# EAGLE design 1 (EAGLE 8.5.0)
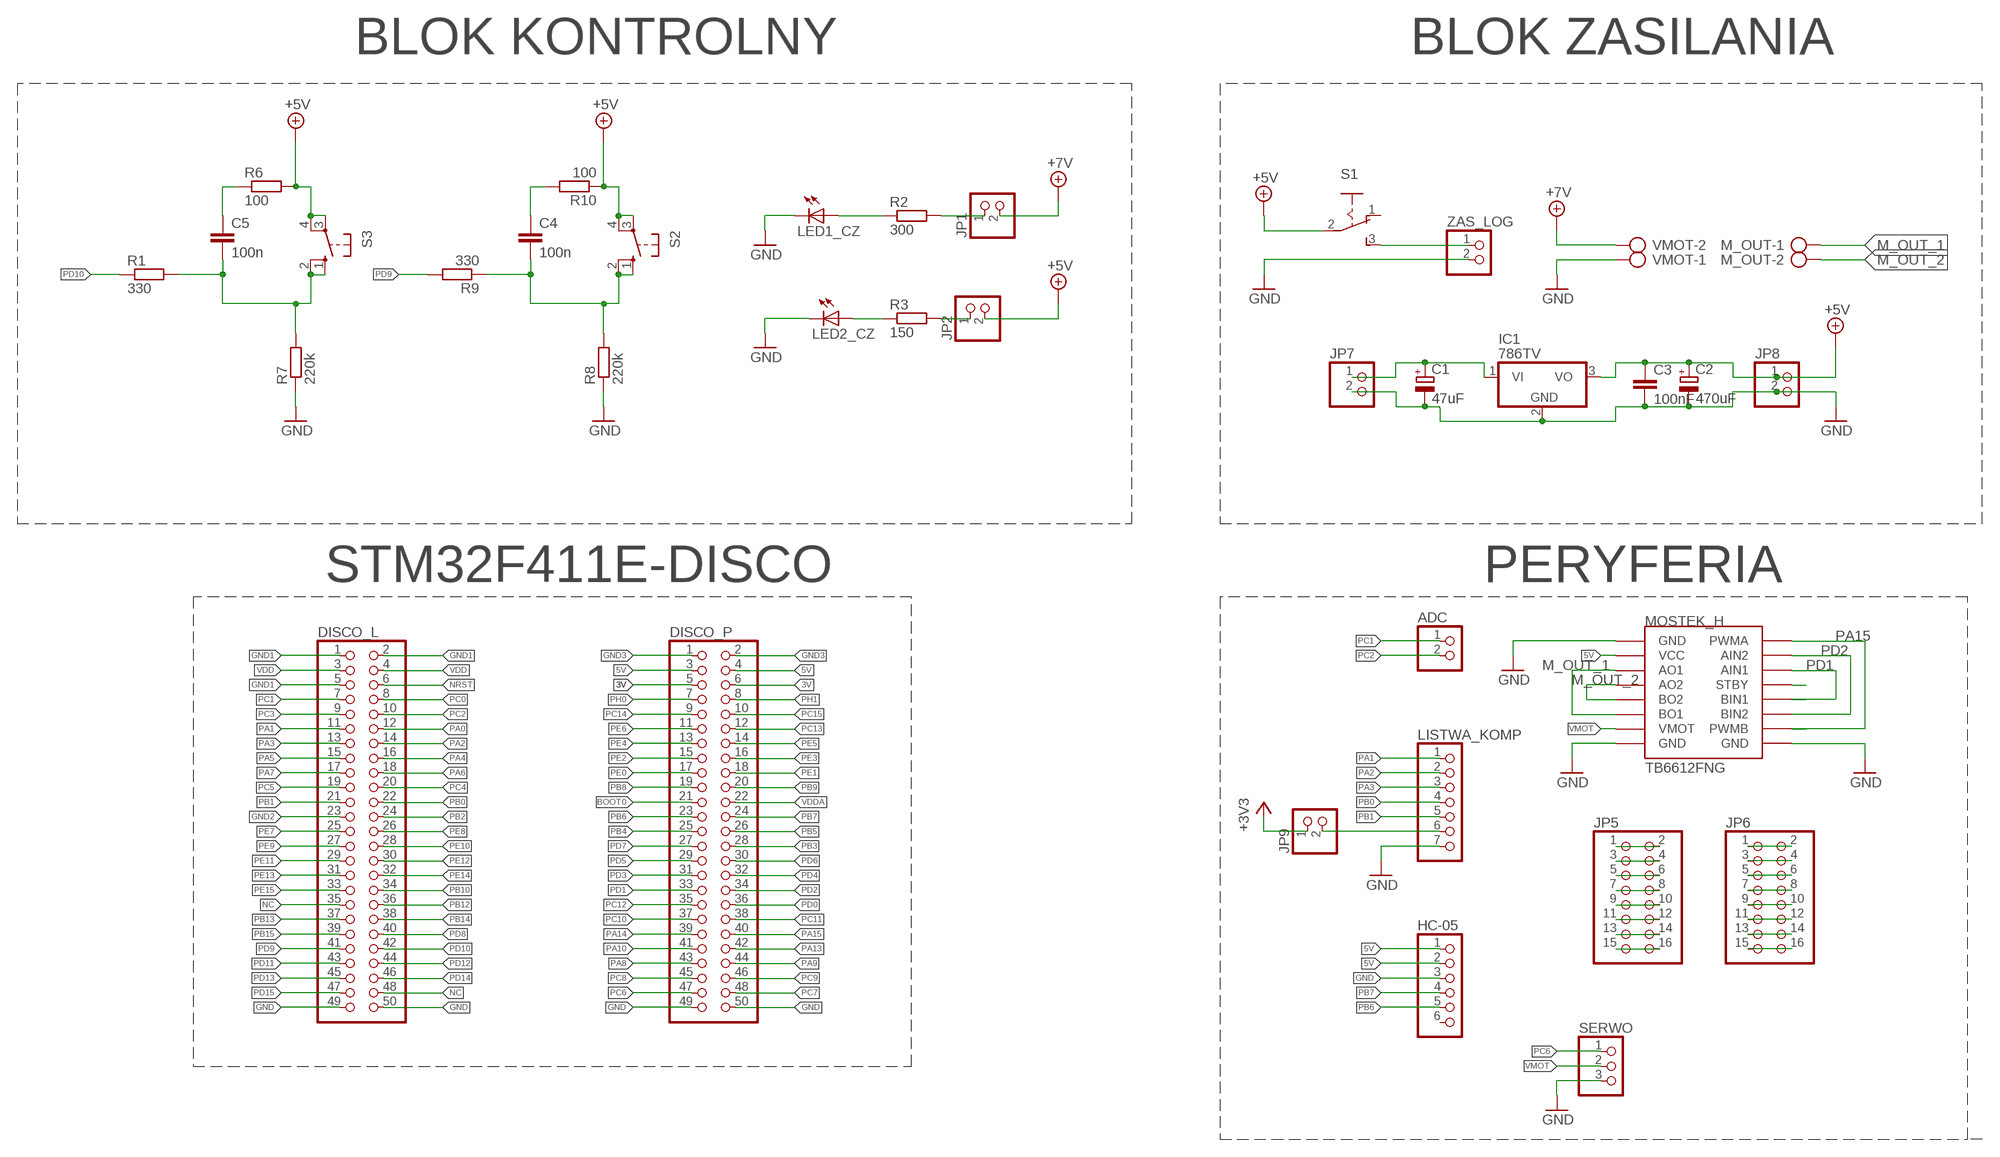
[diagram p0: schematic, sheet 1]

## Parts
ADC  PINHD-1X2  [1X02]
C1  47uF  CPOL-EU153CLV-0405  [153CLV-0405]
C2  470uF  CPOL-EU153CLV-0405  [153CLV-0405]
C3  100nF  C-EU025-024X044  [C025-024X044]
C4  100n  C-EUC1206  [C1206]
C5  100n  C-EUC1206  [C1206]
DISCO_L  PINHD-2X25  [2X25]
DISCO_P  PINHD-2X25  [2X25]
HC-05  PINHD-1X6  [1X06]
IC1  786TV  [TO220V]
JP1  PINHD-1X2  [1X02]
JP2  PINHD-1X2  [1X02]
JP5  PINHD-2X8  [2X08]
JP6  PINHD-2X8  [2X08]
JP7  PINHD-1X2  [1X02]
JP8  PINHD-1X2  [1X02]
JP9  PINHD-1X2  [1X02]
LED1_CZ  LEDSML1206  [SML1206]
LED2_CZ  LEDSML1206  [SML1206]
LISTWA_KOMP  PINHD-1X7  [1X07]
M_OUT  AK300/2  [AK300/2]
MOSTEK_H  MODUL_POLOLU  [MODUL_POLOLU]
R1  330  R-EU_R0805  [R0805]
R2  300  R-EU_R0805  [R0805]
R3  150  R-EU_R0805  [R0805]
R6  100  R-EU_R0805  [R0805]
R7  220k  R-EU_R0805  [R0805]
R8  220k  R-EU_R0805  [R0805]
R9  330  R-EU_R0805  [R0805]
R10  100  R-EU_R0805  [R0805]
S1  255SB  [255SB]
S2  10-XX  [B3F-10XX]
S3  10-XX  [B3F-10XX]
SERWO  PINHD-1X3  [1X03]
VMOT  AK300/2  [AK300/2]
ZAS_LOG  PINHD-1X2/90  [1X02/90]

## Nets
3V: DISCO_P.5 DISCO_P.6 JP9.1 ; supply symbol labelled +3V3
5V: C2.+ C3.1 DISCO_P.3 DISCO_P.4 HC-05.1 HC-05.2 IC1.3(VO) JP2.2 JP8.1 MOSTEK_H.VCC R6.2 R10.1 S1.2(P) S2.3(P) S2.4(P1) S3.3(P) S3.4(P1) ; supply symbol labelled +5V
A: JP9.2 LISTWA_KOMP.6
BOOT0: DISCO_P.21
GND: C1.- C2.- C3.2 DISCO_L.49 DISCO_L.50 DISCO_P.49 DISCO_P.50 HC-05.3 IC1.2(GND) JP7.2 JP8.2 LED1_CZ.C LED2_CZ.C LISTWA_KOMP.7 MOSTEK_H.GND1(GND) MOSTEK_H.GND2(GND) MOSTEK_H.GND3(GND) R7.1 R8.1 SERWO.3 VMOT.1 ZAS_LOG.2
GND1: DISCO_L.1 DISCO_L.2 DISCO_L.5
GND2: DISCO_L.23
GND3: DISCO_P.1 DISCO_P.2
M_OUT_1: M_OUT.1 MOSTEK_H.AO1 MOSTEK_H.BO1
M_OUT_2: M_OUT.2 MOSTEK_H.A02(AO2) MOSTEK_H.BO2
N$1: JP5.1 JP5.2
N$2: JP5.3 JP5.4
N$3: JP5.5 JP5.6
N$4: JP5.7 JP5.8
N$5: JP5.9 JP5.10
N$6: JP5.11 JP5.12
N$7: JP5.13 JP5.14
N$8: JP5.15 JP5.16
N$9: JP6.1 JP6.2
N$10: JP6.3 JP6.4
N$11: JP6.5 JP6.6
N$12: JP6.7 JP6.8
N$13: JP6.9 JP6.10
N$14: JP6.11 JP6.12
N$15: JP6.13 JP6.14
N$16: JP6.15 JP6.16
N$17: C1.+ IC1.1(VI) JP7.1
N$18: S1.3(S) ZAS_LOG.1
N$19: LED1_CZ.A R2.1
N$20: LED2_CZ.A R3.1
N$21: C4.2 R8.2 R9.1 S2.1(S) S2.2(S1)
N$22: JP1.1 R2.2
N$23: C5.2 R1.2 R7.2 S3.1(S) S3.2(S1)
N$24: JP2.1 R3.2
N$27: C4.1 R10.2
N$28: C5.1 R6.1
N$56: MOSTEK_H.STBY
NC: DISCO_L.35 DISCO_L.48
NRST: DISCO_L.6
PA0: DISCO_L.12
PA1: DISCO_L.11 LISTWA_KOMP.1
PA2: DISCO_L.14 LISTWA_KOMP.2
PA3: DISCO_L.13 LISTWA_KOMP.3
PA4: DISCO_L.16
PA5: DISCO_L.15
PA6: DISCO_L.18
PA7: DISCO_L.17
PA8: DISCO_P.43
PA9: DISCO_P.44
PA10: DISCO_P.41
PA13: DISCO_P.42
PA14: DISCO_P.39
PA15: DISCO_P.40 MOSTEK_H.PWMA MOSTEK_H.PWMB
PB0: DISCO_L.22 LISTWA_KOMP.4
PB1: DISCO_L.21 LISTWA_KOMP.5
PB2: DISCO_L.24
PB3: DISCO_P.28
PB4: DISCO_P.25
PB5: DISCO_P.26
PB6: DISCO_P.23 HC-05.5
PB7: DISCO_P.24 HC-05.4
PB8: DISCO_P.19
PB9: DISCO_P.20
PB10: DISCO_L.34
PB12: DISCO_L.36
PB13: DISCO_L.37
PB14: DISCO_L.38
PB15: DISCO_L.39
PC0: DISCO_L.8
PC1: ADC.1 DISCO_L.7
PC2: ADC.2 DISCO_L.10
PC3: DISCO_L.9
PC4: DISCO_L.20
PC5: DISCO_L.19
PC6: DISCO_P.47 SERWO.1
PC7: DISCO_P.48
PC8: DISCO_P.45
PC9: DISCO_P.46
PC10: DISCO_P.37
PC11: DISCO_P.38
PC12: DISCO_P.35
PC13: DISCO_P.12
PC14: DISCO_P.9
PC15: DISCO_P.10
PD0: DISCO_P.36
PD1: DISCO_P.33 MOSTEK_H.AIN1 MOSTEK_H.BIN1
PD2: DISCO_P.34 MOSTEK_H.AIN2 MOSTEK_H.BIN2
PD3: DISCO_P.31
PD4: DISCO_P.32
PD5: DISCO_P.29
PD6: DISCO_P.30
PD7: DISCO_P.27
PD8: DISCO_L.40
PD9: DISCO_L.41 R9.2
PD10: DISCO_L.42 R1.1
PD11: DISCO_L.43
PD12: DISCO_L.44
PD13: DISCO_L.45
PD14: DISCO_L.46
PD15: DISCO_L.47
PE0: DISCO_P.17
PE1: DISCO_P.18
PE2: DISCO_P.15
PE3: DISCO_P.16
PE4: DISCO_P.13
PE5: DISCO_P.14
PE6: DISCO_P.11
PE7: DISCO_L.25
PE8: DISCO_L.26
PE9: DISCO_L.27
PE10: DISCO_L.28
PE11: DISCO_L.29
PE12: DISCO_L.30
PE13: DISCO_L.31
PE14: DISCO_L.32
PE15: DISCO_L.33
PH0: DISCO_P.7
PH1: DISCO_P.8
VDD: DISCO_L.3 DISCO_L.4
VDDA: DISCO_P.22
VMOT: JP1.2 MOSTEK_H.VMOT SERWO.2 VMOT.2 ; supply symbol labelled +7V
Unconnected: HC-05.6 S1.1(O)

## Notes on the sheet
- BLOK KONTROLNY | BLOK ZASILANIA
- STM32F411E-DISCO | PERYFERIA

## Library data of the parts
ADC JP1 JP2 JP7-JP9 ZAS_LOG = pinhead:PINHD-1X2: PIN HEADER
C1 C2 = rcl:CPOL-EU: POLARIZED CAPACITOR, European symbol
C3 = rcl:C-EU: CAPACITOR, European symbol
C4 C5 = rcl:C-EU: CAPACITOR, European symbol; SPICEPREFIX: C
DISCO_L DISCO_P = pinhead:PINHD-2X25: PIN HEADER
HC-05 = pinhead:PINHD-1X6: PIN HEADER
IC1 = linear:78*: Positive VOLTAGE REGULATOR Source: http://cache.national.com/ds/LM/LM78L05.pdf http://www.fairchildsemi.com/ds/LM/LM7805.pdf
JP5 JP6 = pinhead:PINHD-2X8: PIN HEADER
LED1_CZ LED2_CZ = led:LED: LED OSRAM: - CHIPLED LG R971, LG N971, LY N971, LG Q971, LY Q971, LO R971, LY R971 LH N974, LH R974 LS Q976, LO Q976, LY Q976 LO Q996 - Hyper CHIPLED LW Q18S LB Q993, LB Q99A, LB R99A - SideLED LS A670, LO A670, LY A670, LG A670, LP A670 LB A673, LV A673, LT A673, LW A673 LH A674 LY A675 LS A676, LA A676, LO A676, LY A676, LW A676 LS A679, LY A679, LG A679 - Hyper Micro SIDELED® LS Y876, LA Y876, LO Y876, LY Y876 LT Y87S - SmartLED LW L88C, LW L88S LB L89C, LB L89S, LG L890 LS L89K, LO L89K, LY L89K LS L896, LA L896, LO L896, LY L896 - TOPLED LS T670, LO T670, LY T670, LG T670, LP T670 LSG T670, LSP T670, LSY T670, LOP T670, LYG T670 LG T671, LOG T671, LSG T671 LB T673, LV T673, LT T673, LW T673 LH T674 LS T676, LA T676, LO T676, LY T676, LB T676, LH T676, LSB T676, LW T676 LB T67C, LV T67C, LT T67C, LS T67K, LO T67K, LY T67K, LW E67C LS E67B, LA E67B, LO E67B, LY E67B, LB E67C, LV E67C, LT E67C LW T67C LS T679, LY T679, LG T679 LS T770, LO T770, LY T770, LG T770, LP T770 LB T773, LV T773, LT T773, LW T773 LH T774 LS E675, LA E675, LY E675, LS T675 LS T776, LA T776, LO T776, LY T776, LB T776 LHGB T686 LT T68C, LB T68C - Hyper Mini TOPLED® LB M676 - Mini TOPLED Santana® LG M470 LS M47K, LO M47K, LY M47K Source: http://www.osram.convergy.de LUXEON: - LUMILED® LXK2-PW12-R00, LXK2-PW12-S00, LXK2-PW14-U00, LXK2-PW14-V00 LXK2-PM12-R00, LXK2-PM12-S00, LXK2-PM14-U00 LXK2-PE12-Q00, LXK2-PE12-R00, LXK2-PE12-S00, LXK2-PE14-T00, LXK2-PE14-U00 LXK2-PB12-K00, LXK2-PB12-L00, LXK2-PB12-M00, LXK2-PB14-N00, LXK2-PB14-P00, LXK2-PB14-Q00 LXK2-PR12-L00, LXK2-PR12-M00, LXK2-PR14-Q00, LXK2-PR14-R00 LXK2-PD12-Q00, LXK2-PD12-R00, LXK2-PD12-S00 LXK2-PH12-R00, LXK2-PH12-S00 LXK2-PL12-P00, LXK2-PL12-Q00, LXK2-PL12-R00 Source: www.luxeon.com KINGBRIGHT: KA-3528ASYC Source: www.kingbright.com
LISTWA_KOMP = pinhead:PINHD-1X7: PIN HEADER
M_OUT VMOT = con-ptr500:AK300/2: CONNECTOR; OC_FARNELL: unknown; OC_NEWARK: unknown
MOSTEK_H = TB6612FNG:MODUL_POLOLU
R1-R3 R6-R10 = rcl:R-EU_: RESISTOR, European symbol; SPICEPREFIX: R
S1 = switch:255SB: SLIDING SWITCH Distributor Buerklin, 11G810
S2 S3 = switch-omron:10-XX: OMRON SWITCH; MPN: B3F-1000; OC_FARNELL: 176432; OC_NEWARK: 36M3542
SERWO = pinhead:PINHD-1X3: PIN HEADER

## Board
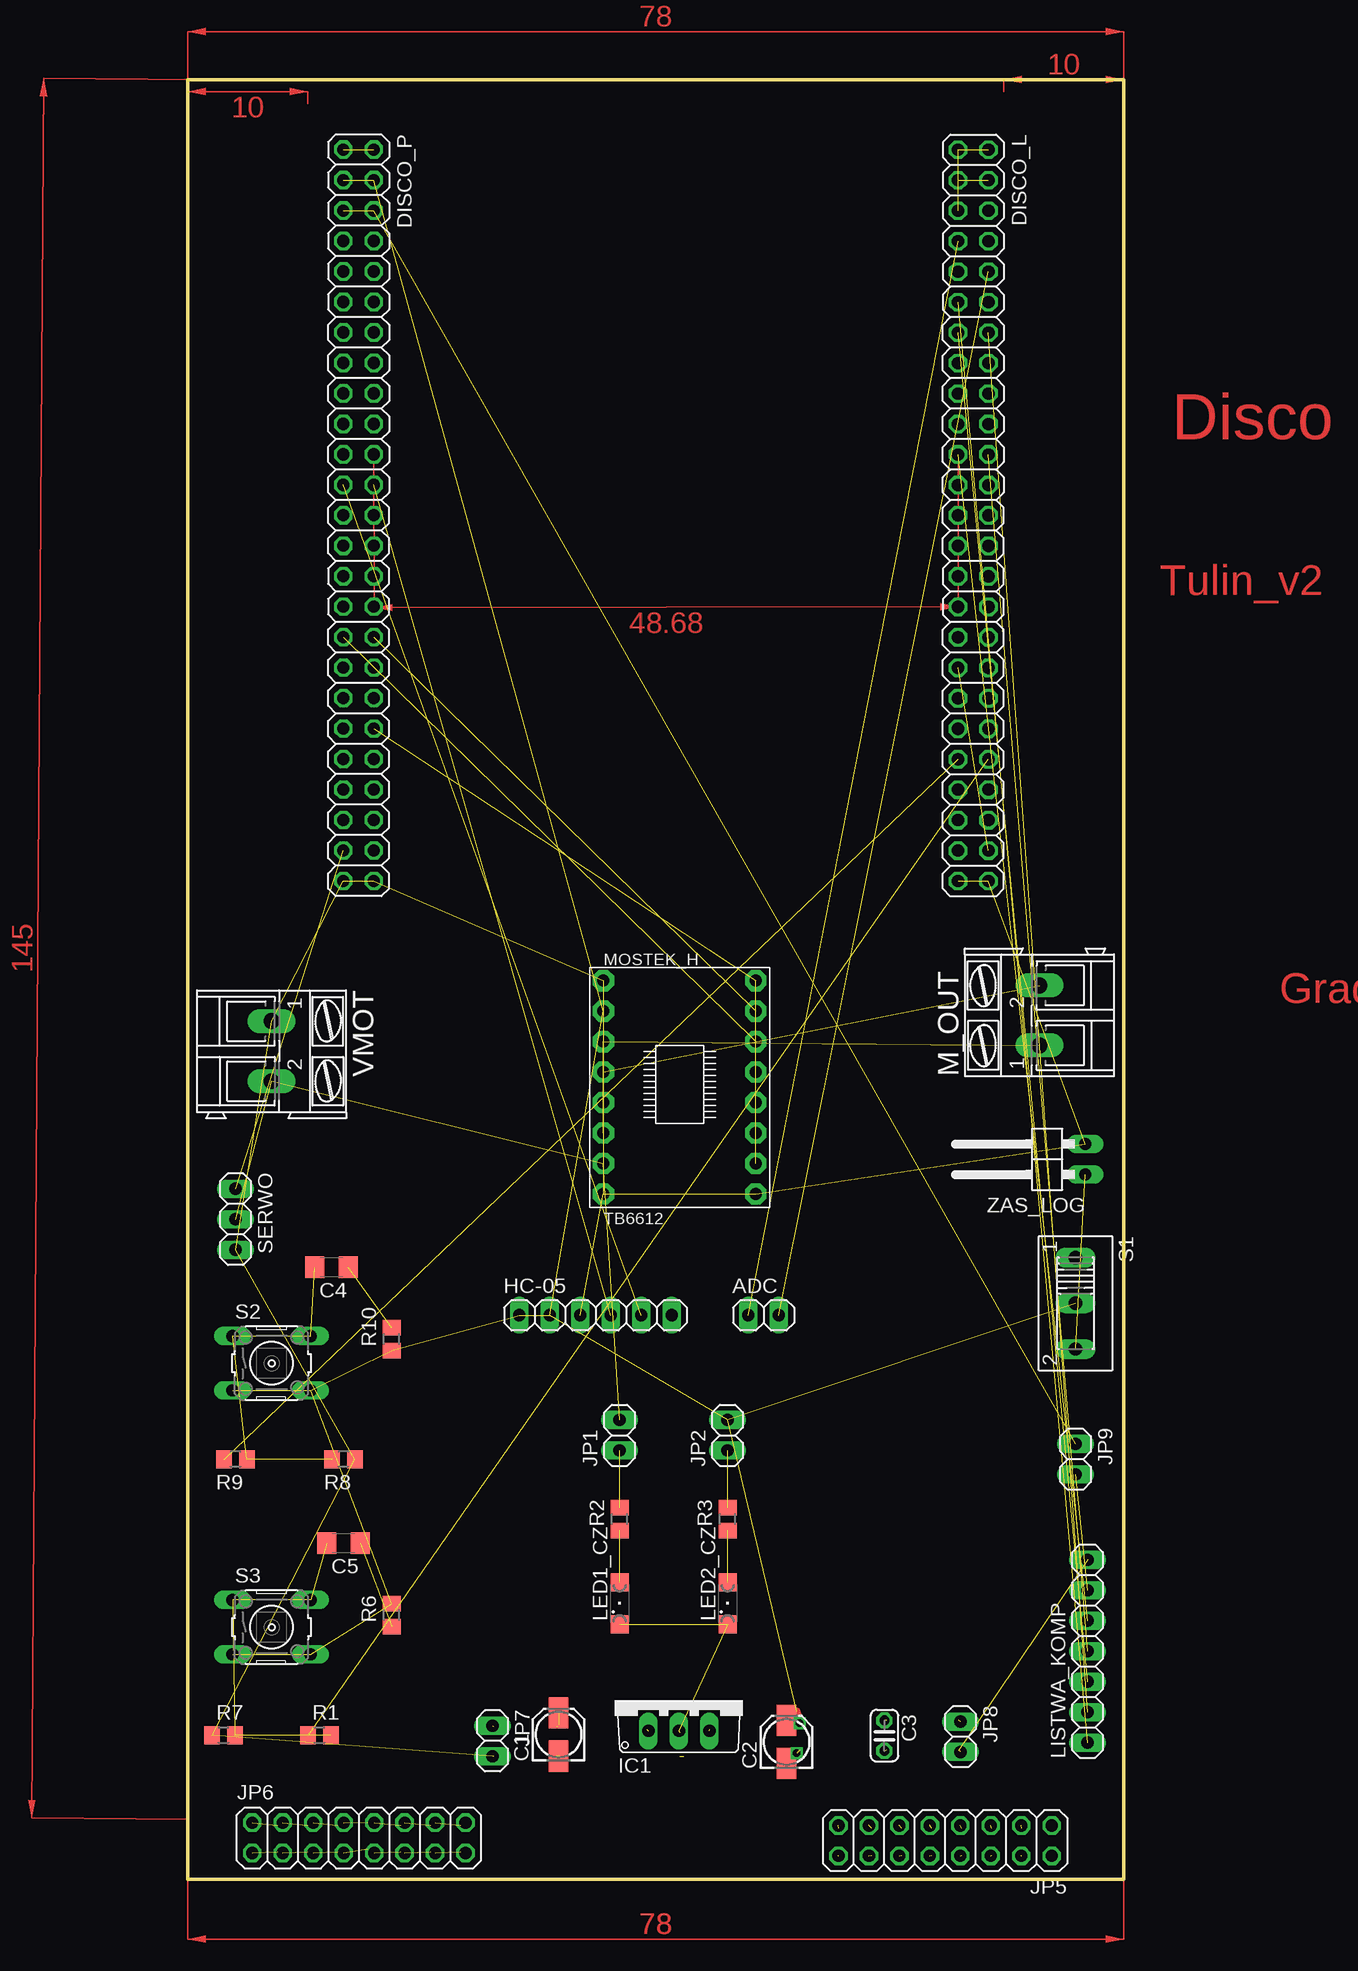
[diagram p1: board, top side]
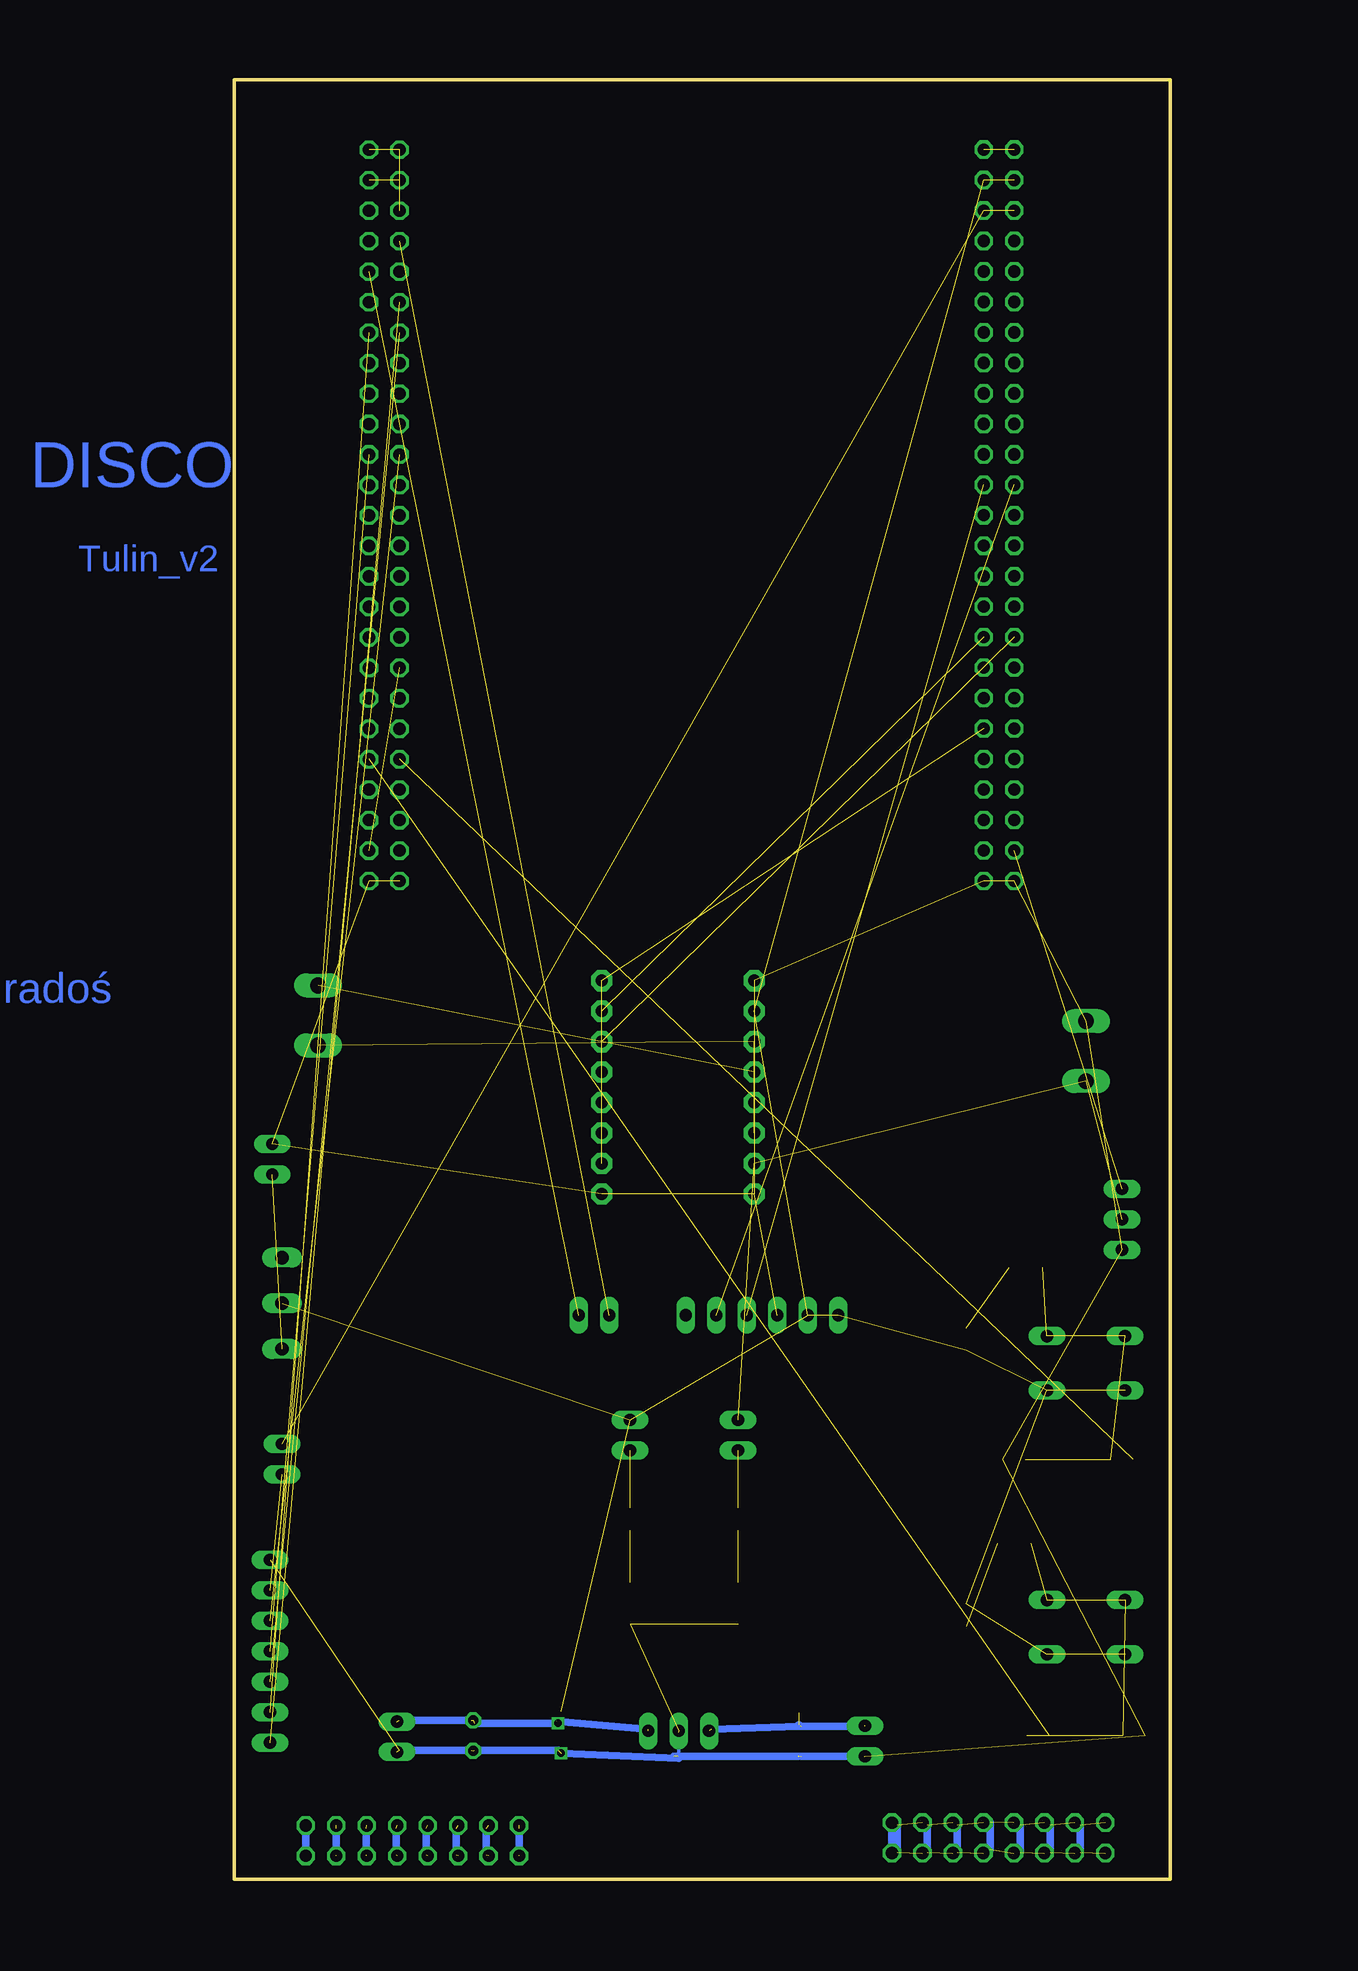
[diagram p2: board, bottom side, seen from below]

Size 78 x 150 mm. Coordinates in mm from the lower left corner, seen from the top.
Outline: 0,0 78,0 78,150 0,150 0,0
Copper layers (1*16): Top 0.035mm / dielectric 1.5mm / Bottom 0.035mm
Design rules "default": minimum track width 10mil, minimum drill 24mil, track to track 8mil, track to pad 8mil, pad to pad 8mil, via to via 8mil, smd to smd 8mil, copper to edge 40mil, drill to drill 8mil, minimum pad ring 10mil, minimum via ring 8mil, stop-mask expansion 4mil, vias tented up to drill 0mil, thermal gap 10mil

### Footprints (pad centres in the part's own frame; a part is rotated, then mirrored left to right if it is on the bottom)
1X02 = drill 1.016 long: 1 -1.27,0; 2 1.27,0
153CLV-0405 = smd 2.6 x 1.6: + 1.8,0; - -1.8,0
C025-024X044 = drill 0.813 octagon: 1 -1.27,0; 2 1.27,0
C1206 = smd 1.6 x 1.8: 1 -1.4,0; 2 1.4,0
2X25 = drill 1.016 octagon: 1 -30.48,-1.27; 2 -30.48,1.27; 3 -27.94,-1.27; 4 -27.94,1.27; 5 -25.4,-1.27; 6 -25.4,1.27; 7 -22.86,-1.27; 8 -22.86,1.27; 9 -20.32,-1.27; 10 -20.32,1.27; 11 -17.78,-1.27; 12 -17.78,1.27; 13 -15.24,-1.27; 14 -15.24,1.27; 15 -12.7,-1.27; 16 -12.7,1.27; 17 -10.16,-1.27; 18 -10.16,1.27; 19 -7.62,-1.27; 20 -7.62,1.27; 21 -5.08,-1.27; 22 -5.08,1.27; 23 -2.54,-1.27; 24 -2.54,1.27; 25 0,-1.27; 26 0,1.27; 27 2.54,-1.27; 28 2.54,1.27; 29 5.08,-1.27; 30 5.08,1.27; 31 7.62,-1.27; 32 7.62,1.27; 33 10.16,-1.27; 34 10.16,1.27; 35 12.7,-1.27; 36 12.7,1.27; 37 15.24,-1.27; 38 15.24,1.27; 39 17.78,-1.27; 40 17.78,1.27; 41 20.32,-1.27; 42 20.32,1.27; 43 22.86,-1.27; 44 22.86,1.27; 45 25.4,-1.27; 46 25.4,1.27; 47 27.94,-1.27; 48 27.94,1.27; 49 30.48,-1.27; 50 30.48,1.27
1X06 = drill 1.016 long: 1 -6.35,0; 2 -3.81,0; 3 -1.27,0; 4 1.27,0; 5 3.81,0; 6 6.35,0
TO220V = drill 1.016 long: 1 -2.54,-2.54; 2 0,-2.54; 3 2.54,-2.54
2X08 = drill 1.016 octagon: 1 -8.89,-1.27; 2 -8.89,1.27; 3 -6.35,-1.27; 4 -6.35,1.27; 5 -3.81,-1.27; 6 -3.81,1.27; 7 -1.27,-1.27; 8 -1.27,1.27; 9 1.27,-1.27; 10 1.27,1.27; 11 3.81,-1.27; 12 3.81,1.27; 13 6.35,-1.27; 14 6.35,1.27; 15 8.89,-1.27; 16 8.89,1.27
SML1206 = smd 1.5 x 1.5: A 1.75,0; C -1.75,0
1X07 = drill 1.016 long: 1 -7.62,0; 2 -5.08,0; 3 -2.54,0; 4 0,0; 5 2.54,0; 6 5.08,0; 7 7.62,0
AK300/2 = drill 1.321 long: 1 -2.515,0; 2 2.489,0
MODUL_POLOLU = drill 1 pad 1.778 octagon: A02 -6.35,1.27; AIN1 6.35,3.81; AIN2 6.35,6.35; AO1 -6.35,3.81; BIN1 6.35,-1.27; BIN2 6.35,-3.81; BO1 -6.35,-3.81; BO2 -6.35,-1.27; GND1 -6.35,8.89; GND2 -6.35,-8.89; GND3 6.35,-8.89; PWMA 6.35,8.89; PWMB 6.35,-6.35; STBY 6.35,1.27; VCC -6.35,6.35; VMOT -6.35,-6.35
R0805 = smd 1.3 x 1.5: 1 -0.95,0; 2 0.95,0
255SB = drill 1.118 long: 1 -3.81,0; 2 0,0; 3 3.81,0
B3F-10XX = drill 1.016 long: 1 -3.251,2.261; 2 3.251,2.261; 3 -3.251,-2.261; 4 3.251,-2.261
1X03 = drill 1.016 long: 1 -2.54,0; 2 0,0; 3 2.54,0
1X02/90 = drill 1.016 long: 1 -1.27,-3.81; 2 1.27,-3.81

### Placement (x,y rotation side)
ADC  48,47 0 top
C1  30.92,12.06 90 top
C2  49.92,11.44 90 top
C3  58.07,11.96 270 top
C4  12,51 180 top
C5  13,28 180 top
DISCO_L  65.47,113.66 270 top
DISCO_P  14.25,113.68 270 top
HC-05  34,47 0 top
IC1  40.95,14.89 0 top
JP1  36,37 90 top
JP2  45,37 90 top
JP5  63.13,3.2 180 top
JP6  14.28,3.44 0 top
JP7  25.42,11.51 270 top
JP8  64.42,11.86 270 top
JP9  74,35 270 top
LED1_CZ  36,23 90 top
LED2_CZ  45,23 90 top
LISTWA_KOMP  75,19 90 top
M_OUT  71,72 90 top
MOSTEK_H  41,66 0 top
R1  11,12 0 top
R2  36,30 90 top
R3  45,30 90 top
R6  17,22 90 top
R7  3,12 0 top
R8  13,35 180 top
R9  4,35 180 top
R10  17,45 90 top
S1  74,48 270 top
S2  7,43 0 top
S3  7,21 0 top
SERWO  4,55 270 top
VMOT  7,69 270 top
ZAS_LOG  71,60 90 top

### Tracks (layer width: path | path; a pad name or v marks a point on that pad's centre or on a via)
3V  (2 unrouted)
5V  (via drill 0.6)  (18 unrouted)
  Top 0.61: v51,13 C2.+ 50.75,14 51.1,13.15
  Bottom 0.61: 51.1,13.15 43.5,12.5 | 58.25,13.25 64.25,13.25 | 58,13 v51,13
A  (1 unrouted)
GND  (via drill 0.6)  (25 unrouted)
  Top 0.61: v50.75,10.5 C2.-
  Bottom 0.305: 41,12.25 40.94,10.08 41,10.25
  Bottom 0.61: 58,10.75 51,10.75 | 58.25,10.75 64.25,10.75 | 25.5,10.25 30.75,10.25 | 31,10.25 41.37,10.25 | 40.94,10.08 v50.75,10.5 | 41,10.25 40.75,10.25
GND1  (2 unrouted)
GND3  (1 unrouted)
M_OUT_1  (2 unrouted)
M_OUT_2  (2 unrouted)
N$1
  Bottom 0.61: JP5.2 JP5.1
N$2  (2 unrouted)
  Bottom 0.61: 69.5,4.25 69.5,2
N$3  (2 unrouted)
  Bottom 0.61: 67,4.25 67,2
N$4  (2 unrouted)
  Bottom 0.61: 64.5,4.25 64.5,2
N$5  (2 unrouted)
  Bottom 0.61: 62,4.25 62,2
N$6  (2 unrouted)
  Bottom 0.61: 59.5,4.25 59.5,2
N$7  (2 unrouted)
  Bottom 0.61: 57,4.25 57,2
N$8  (2 unrouted)
  Bottom 0.61: 54.25,4.25 54.25,2
N$9  (2 unrouted)
  Bottom 0.61: 7.5,4.5 7.5,2.25
N$10  (2 unrouted)
  Bottom 0.61: 10,4.5 10,2.25
N$11  (2 unrouted)
  Bottom 0.61: 12.5,4.5 12.5,2.25
N$12  (2 unrouted)
  Bottom 0.61: 15,2.5 15,4.75
N$13  (2 unrouted)
  Bottom 0.61: 17.75,4.5 17.75,2.25
N$14  (2 unrouted)
  Bottom 0.61: 20.25,4.5 20.25,2.25
N$15  (2 unrouted)
  Bottom 0.61: 22.75,4.5 22.75,2.25
N$16
  Bottom 0.61: JP6.15 JP6.16
N$17  (4 unrouted)
  Bottom 0.61: 25.5,12.75 30.75,12.75 30.92,12.86 | 30.83,12.73 38.25,12.5
N$18  (1 unrouted)
N$19  (1 unrouted)
N$20  (1 unrouted)
N$21  (4 unrouted)
N$22  (1 unrouted)
N$23  (4 unrouted)
N$24  (1 unrouted)
N$27  (1 unrouted)
N$28  (1 unrouted)
NC  (1 unrouted)
PA1  (1 unrouted)
PA2  (1 unrouted)
PA3  (1 unrouted)
PA15  (2 unrouted)
PB0  (1 unrouted)
PB1  (1 unrouted)
PB6  (1 unrouted)
PB7  (1 unrouted)
PC1  (1 unrouted)
PC2  (1 unrouted)
PC6  (1 unrouted)
PD1  (2 unrouted)
PD2  (2 unrouted)
PD9  (1 unrouted)
PD10  (1 unrouted)
VDD  (1 unrouted)
VMOT  (3 unrouted)
(copper drawn outside any net)
  shapes: Top area x7

### Text on the board
Top: Disco | Tulin_v2 | Gradoś | H
Bottom: DISCO | Tulin_v2 | Gradoś | H